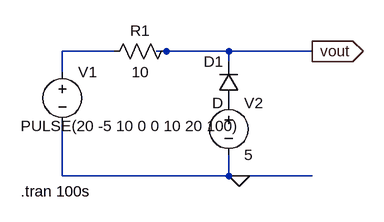
[diagram p0: schematic clamper.asc]
clamper.asc, the LTspice schematic file:
Version 4
SHEET 1 880 680
WIRE 48 96 -32 96
WIRE 128 96 112 96
WIRE 224 96 128 96
WIRE 352 96 224 96
WIRE 224 112 224 96
WIRE -32 128 -32 96
WIRE -32 288 -32 208
WIRE 224 288 224 256
WIRE 224 288 -32 288
WIRE 240 288 224 288
WIRE 352 288 240 288
FLAG 240 288 0
FLAG 352 96 vout
IOPIN 352 96 Out
SYMBOL voltage -32 112 R0
WINDOW 3 -64 99 Left 2
WINDOW 123 0 0 Left 0
WINDOW 39 0 0 Left 0
SYMATTR Value PULSE(20 -5 10 0 0 10 20 100)
SYMATTR InstName V1
SYMBOL res 144 80 R90
WINDOW 0 0 56 VBottom 2
WINDOW 3 32 56 VTop 2
SYMATTR InstName R1
SYMATTR Value 10
SYMBOL diode 240 176 R180
WINDOW 0 24 64 Left 2
WINDOW 3 24 0 Left 2
SYMATTR InstName D1
SYMBOL voltage 224 160 R0
WINDOW 123 0 0 Left 0
WINDOW 39 0 0 Left 0
SYMATTR InstName V2
SYMATTR Value 5
TEXT -96 312 Left 2 !.tran 100s

The netlist it stands for:
* clamper.asc
V1 N001 0 PULSE(20 -5 10 0 0 10 20 100)
R1 vout N001 10
D1 P001 vout D
V2 P001 0 5
.model D D
.lib standard.dio
.tran 100s
.backanno
.end